# EasyEDA Pro project 300A Hall Power Meter.eprj

# Schematic Schematic1

## Sheets
1 Current Meter: Board Name: Board1; Create Date: 2026-04-24; Page Name: Current Meter; Project Name: 300A Hall Power Meter; Schematic Name: Schematic1; Update Date: 2026-05-06; Company: StarBound; Drawn: Soutsiou S.; Page Size: A4; Version: V1.0
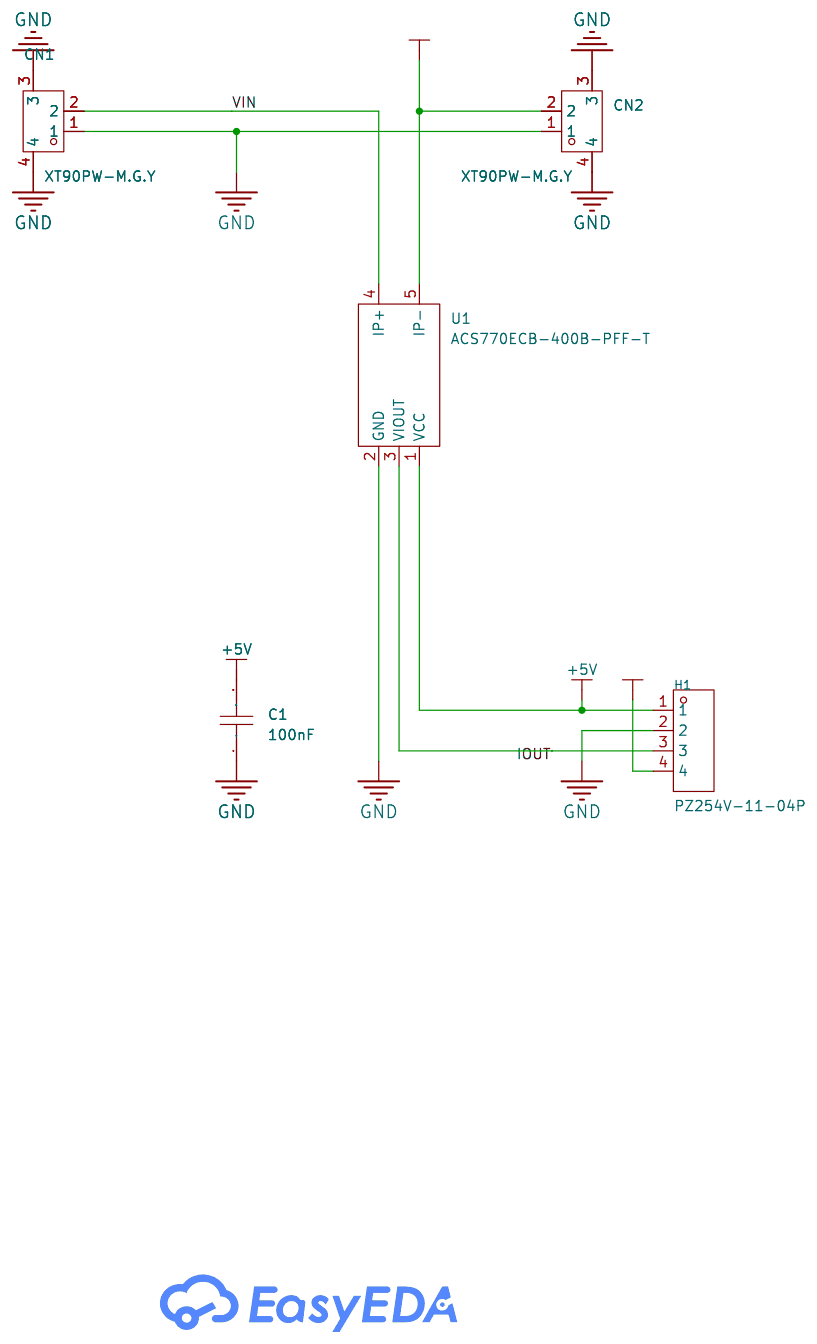
[diagram p0: Current Meter]
2 Buck Converter: Create Date: 2026-04-25; Page Name: Buck Converter; Company: EasyEDA.com
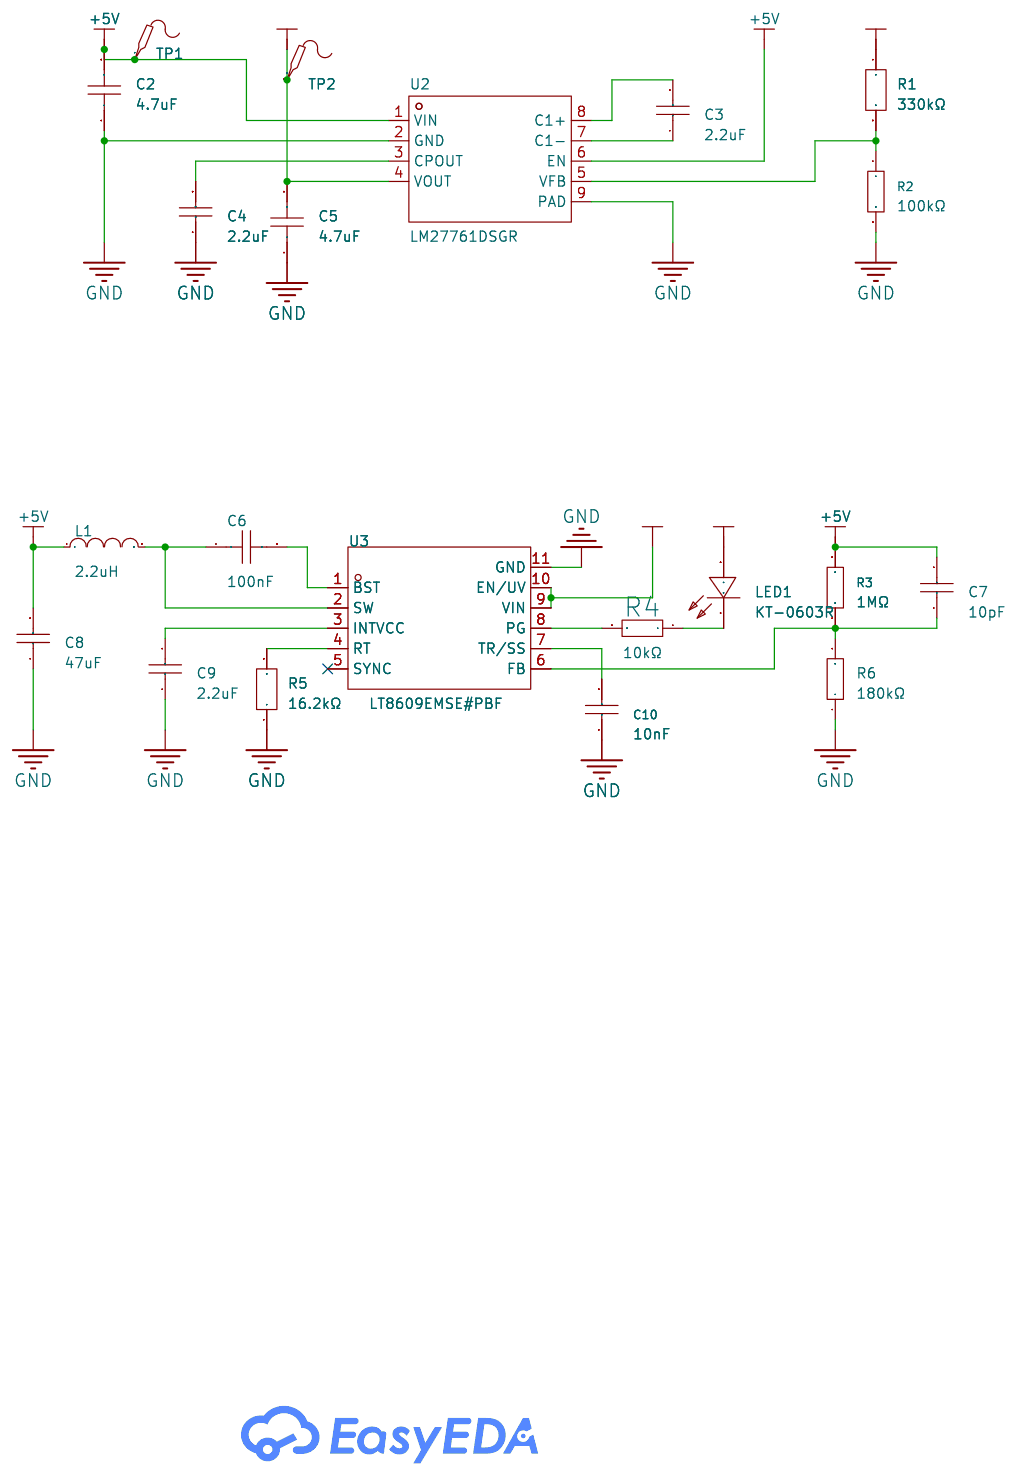
[diagram p1: Buck Converter]
3 Signal Processing: Create Date: 2026-04-25; Page Name: Signal Processing; Company: EasyEDA.com
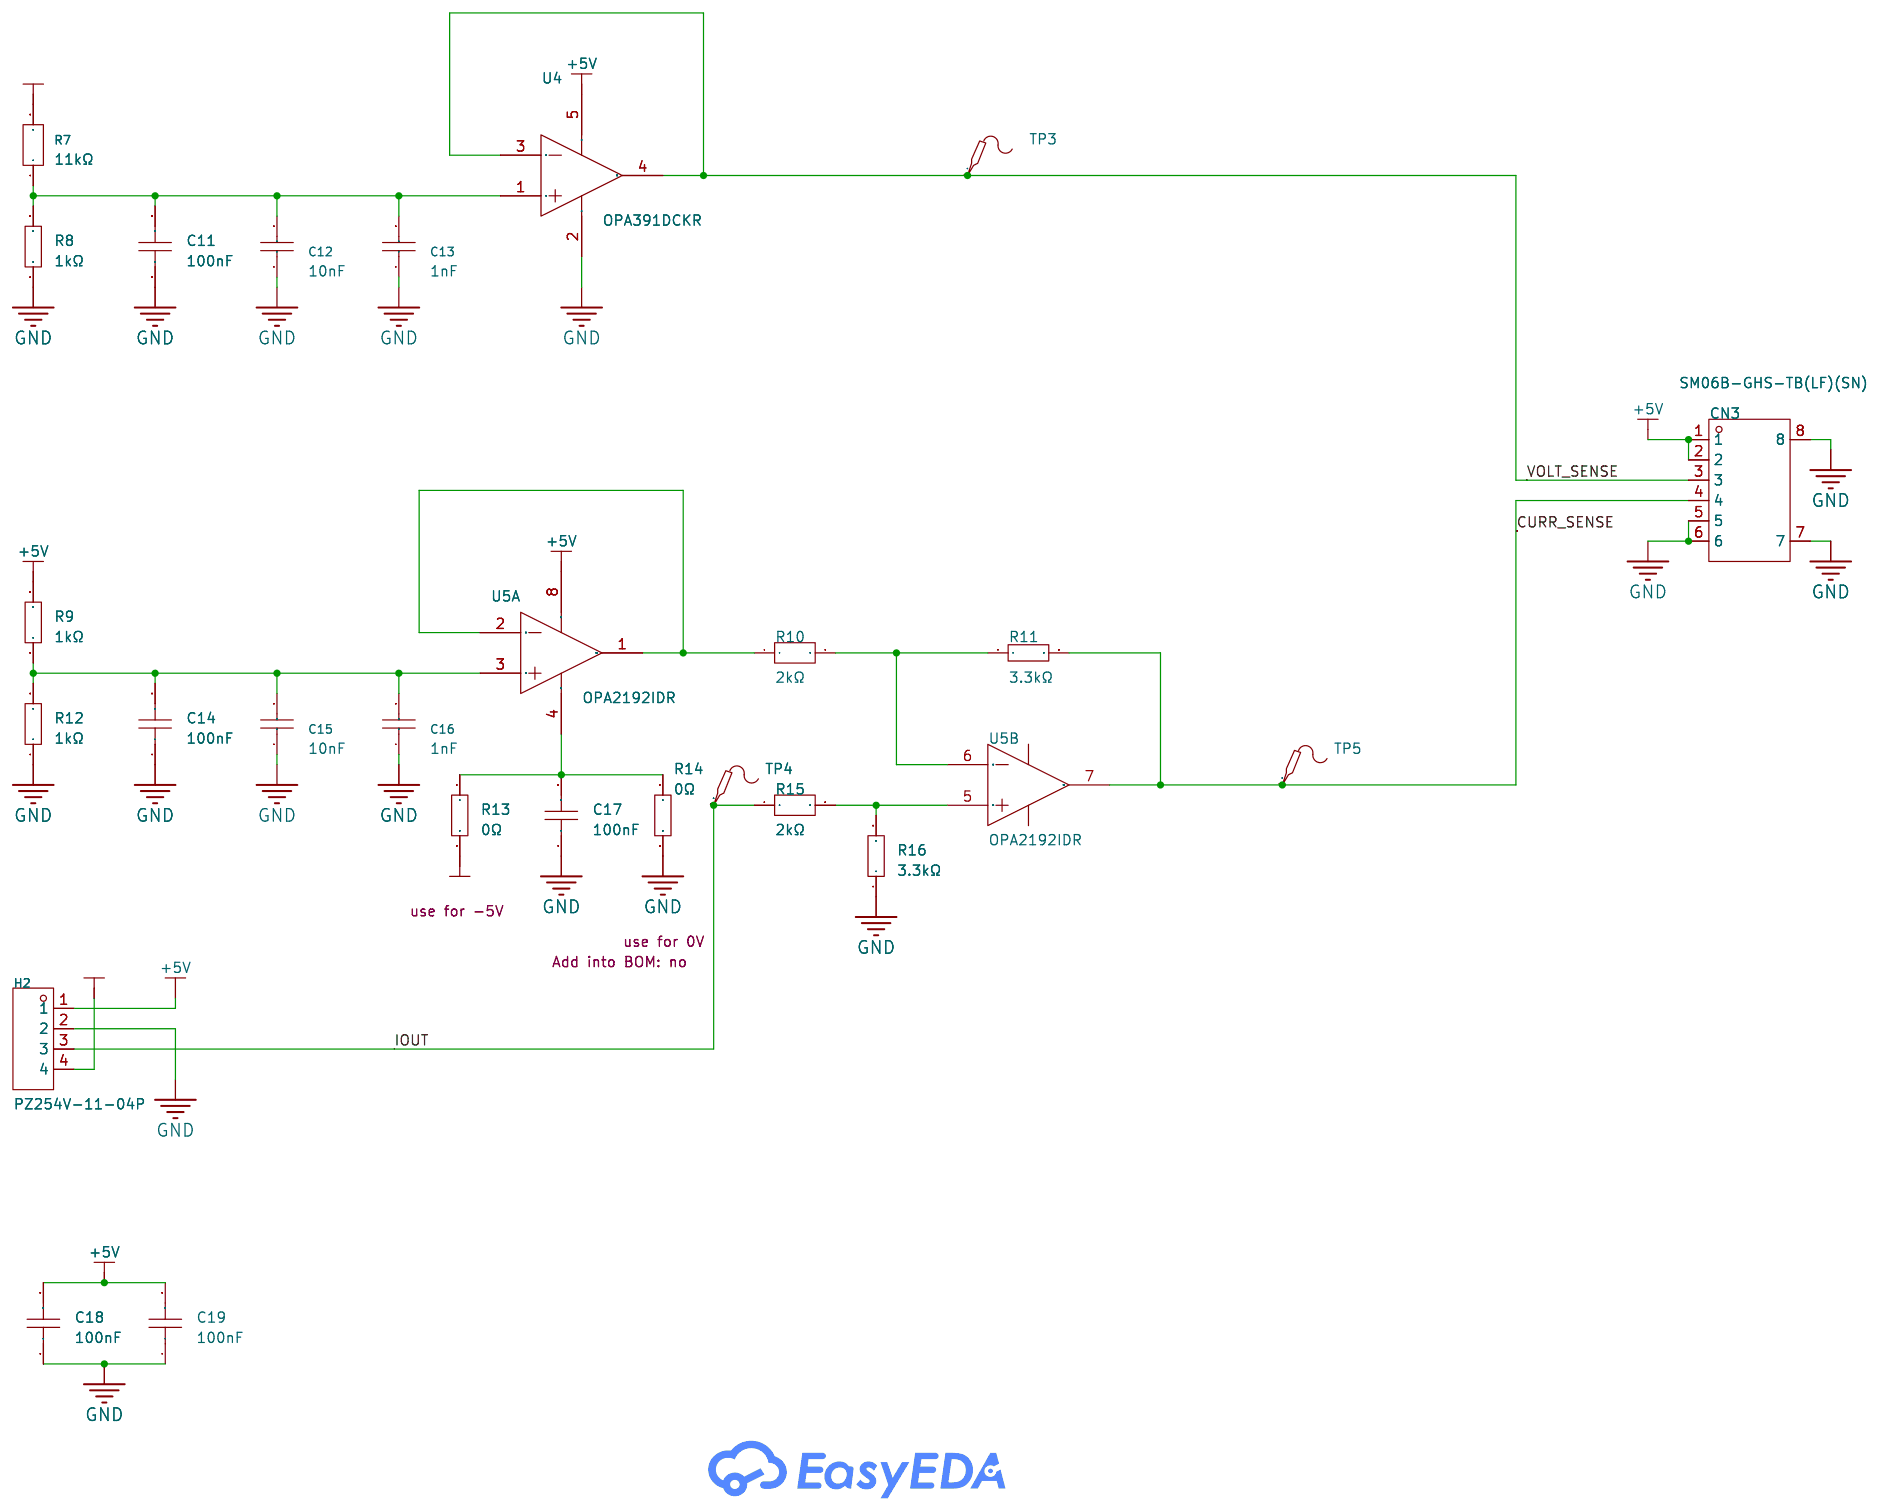
[diagram p2: Signal Processing]

## Parts
sheet Buck Converter
C2  4.7uF  [C0603]
C3  2.2uF  [C0603]
C4  2.2uF  [C0603]
C5  4.7uF  [C0603]
C6  100nF  [C0603]
C7  10pF  [C0603]
C8  47uF  [C0805]
C9  2.2uF  [C0603]
C10  10nF  [C0603]
L1  2.2uH  [IND-SMD_L4.4-W4.0_PHC0420]
LED1  KT-0603R  [LED0603-RD]
R1  330kΩ  [R0603]
R2  100kΩ  [R0603]
R3  1MΩ  [R0603]
R4  10kΩ  [R0603]
R5  16.2kΩ  [R0603]
R6  180kΩ  [R0603]
TP1  -  [Test-Point-0.5mm]
TP2  -  [Test-Point-0.5mm]
U2  LM27761DSGR  [WSON-8_L2.0-W2.0-P0.65-BL-EP]
U3  LT8609EMSE#PBF  [MSOP-10_L3.0-W3.0-P0.50-LS5.0-BL-EP]
sheet Current Meter
C1  100nF  [C0402]
CN1  XT90PW-M.G.Y  [CONN-TH_XT90PW-M.G.Y]  (no BOM)
CN2  XT90PW-M.G.Y  [CONN-TH_XT90PW-M.G.Y]  (no BOM)
H1  PZ254V-11-04P  [HDR-TH_4P-P2.54-V-M]
U1  ACS770ECB-400B-PFF-T  [CB-5_L13.0-W10.0-P1.91-LS21.4-BR]
sheet Signal Processing
C11  100nF  [C0402]
C12  10nF  [C0603]
C13  1nF  [C0603]
C14  100nF  [C0402]
C15  10nF  [C0603]
C16  1nF  [C0603]
C17  100nF  [C0402]
C18  100nF  [C0402]
C19  100nF  [C0402]
CN3  SM06B-GHS-TB(LF)(SN)  [CONN-TH_SM06B-GHS-TB-LF-SN]
H2  PZ254V-11-04P  [HDR-TH_4P-P2.54-V-M]  (no BOM)
R7  11kΩ  [R0603]
R8  1kΩ  [R0603]
R9  1kΩ  [R0603]
R10  2kΩ  [R0603]
R11  3.3kΩ  [R0603]
R12  1kΩ  [R0603]
R13  0Ω  [R0603]
R14  0Ω  [R0603]  (no BOM)
R15  2kΩ  [R0603]
R16  3.3kΩ  [R0603]
TP3  -  [Test-Point-0.5mm]
TP4  -  [Test-Point-0.5mm]
TP5  -  [Test-Point-0.5mm]
U4  OPA391DCKR  [SC-70-5_L2.1-W1.3-P0.65-LS2.1-BR]
U5  OPA2192IDR  [SOIC-8_L4.9-W3.9-P1.27-LS6.0-BL]  (sections 1,2)

## Library data of the parts
C2 C5 = CL10A475KO8NNNC: LCSC Part Name: 4.7uF ±10% 16V; Supplier Part: C19666; Manufacturer: SAMSUNG(三星); Supplier Footprint: 0603; JLCPCB Part Class: Basic Part; Datasheet: https://item.szlcsc.com/datasheet/CL10A475KO8NNNC/20375.html; Supplier: LCSC; Tolerance: ±10%; Voltage Rating: 16V; Temperature Coefficient: X5R
C3 C4 C9 = CL10A225KO8NNNC: LCSC Part Name: 2.2uF ±10% 16V; Supplier Part: C23630; Manufacturer: SAMSUNG(三星); Supplier Footprint: 0603; JLCPCB Part Class: Basic Part; Datasheet: https://item.szlcsc.com/datasheet/CL10A225KO8NNNC/24366.html; Supplier: LCSC; Tolerance: ±10%; Voltage Rating: 16V; Temperature Coefficient: X5R
C6 = CC0603KRX7R9BB104: LCSC Part Name: 100nF ±10% 50V; Supplier Part: C14663; Manufacturer: YAGEO(国巨); Supplier Footprint: 0603; JLCPCB Part Class: Basic Part; Datasheet: https://item.szlcsc.com/datasheet/CC0603KRX7R9BB104/15331.html; Supplier: LCSC; Tolerance: ±10%; Voltage Rating: 50V; Temperature Coefficient: X7R
C7 = CL10C100JB8NNNC: LCSC Part Name: 10pF ±5% 50V; Supplier Part: C1634; Manufacturer: SAMSUNG(三星); Supplier Footprint: 0603; JLCPCB Part Class: Basic Part; Datasheet: https://item.szlcsc.com/datasheet/CL10C100JB8NNNC/1986.html; Supplier: LCSC; Tolerance: ±5%; Voltage Rating: 50V; Temperature Coefficient: C0G
C8 = CL21A476MQYNNNE: LCSC Part Name: 47uF ±20% 6.3V; Supplier Part: C16780; Manufacturer: SAMSUNG(三星); Supplier Footprint: 0805; JLCPCB Part Class: Basic Part; Datasheet: https://item.szlcsc.com/datasheet/CL21A476MQYNNNE/17464.html; Supplier: LCSC; Tolerance: ±20%; Voltage Rating: 6.3V; Temperature Coefficient: X5R
C10 C12 C15 = 0603B103K500NT: LCSC Part Name: 10nF ±10% 50V; Supplier Part: C57112; Manufacturer: FH(风华); Supplier Footprint: 0603; JLCPCB Part Class: Basic Part; Datasheet: https://item.szlcsc.com/datasheet/0603B103K500NT/58143.html; Supplier: LCSC; Tolerance: ±10%; Voltage Rating: 50V; Temperature Coefficient: X7R
L1 = APH0420T2R2M: LCSC Part Name: 2.2uH ±20% 5A; Supplier Part: C5349665; Manufacturer: APV(爱普微); Supplier Footprint: SMD,4.4x4.2mm; JLCPCB Part Class: Extended Part; Datasheet: https://item.szlcsc.com/datasheet/APH0420T2R2M/6135080.html; Supplier: LCSC; Tolerance: ±20%; Current Rating: 4.5A; Current - Saturation(Isat): 5A; DC Resistance(DCR): 58mΩ; Type: Molded Inductor
LED1 = KT-0603R: LCSC Part Name: 0603 红灯 高亮; Supplier Part: C2286; Manufacturer: KENTO; Supplier Footprint: 0603; JLCPCB Part Class: Basic Part; Datasheet: https://item.szlcsc.com/datasheet/KT-0603R/2659.html; Supplier: LCSC; Illumination Color: Red; Voltage - Forward(Vf): 1.8V~2.4V; Power(Watts): 40mW; Forward Current: 20mA; Wavelength - Dominant: 615nm~630nm; Peak Wavelength: 645nm; Diode Configuration: Discrete Diode; Lens Color: Water Clear; Luminous Intensity: 300mcd; Viewing Angle: 120°; Operating Temperature: -40℃~+85℃
R1 = FRC0603F3303TS: LCSC Part Name: 330kΩ ±1% 100mW 厚膜电阻; Supplier Part: C2907027; Manufacturer: FOJAN(富捷); Supplier Footprint: 0603; JLCPCB Part Class: Extended Part; Supplier: LCSC; Type: Thick Film Resistor; Tolerance: ±1%; Power(Watts): 100mW; Voltage-Supply(Max): 75V; Temperature Coefficient: ±100ppm/℃; Operating Temperature: -55℃~+155℃
R2 = RC0603FR-07100KL: LCSC Part Name: 厚膜电阻 100kΩ ±1% 100mW; Supplier Part: C14675; Manufacturer: YAGEO(国巨); Supplier Footprint: 0603; JLCPCB Part Class: Extended Part; Datasheet: https://atta.szlcsc.com/upload/public/pdf/source/20140324/1457707028752.pdf; Supplier: LCSC; Type: Thick Film Resistors; Tolerance: ±1%; Temperature Coefficient: ±100ppm/℃; Operating Temperature Range: -55℃~+155℃
R3 = 0603WAF1004T5E: LCSC Part Name: 1MΩ ±1% 100mW 厚膜电阻; Supplier Part: C22935; Manufacturer: UNI-ROYAL(厚声); Supplier Footprint: 0603; JLCPCB Part Class: Basic Part; Datasheet: https://atta.szlcsc.com/upload/public/pdf/source/20200306/C422600_1E6D84923E4A46A82E41ADD87F860B5C.pdf; Supplier: LCSC; Type: Thick Film Resistors; Tolerance: ±1%; Temperature Coefficient: ±100ppm/℃; Operating Temperature Range: -55℃~+155℃
R4 = 0603WAF1002T5E: LCSC Part Name: 厚膜电阻 10kΩ ±1% 100mW; Supplier Part: C25804; Manufacturer: UNI-ROYAL(厚声); Supplier Footprint: 0603; JLCPCB Part Class: Basic Part; Datasheet: https://item.szlcsc.com/datasheet/0603WAF1002T5E/26547.html; Supplier: LCSC; Type: Thick Film Resistor; Tolerance: ±1%; Power(Watts): 100mW; Voltage-Supply(Max): 75V; Temperature Coefficient: ±100ppm/℃; Operating Temperature: -55℃~+155℃
R5 = RT0603BRD0716K2L: LCSC Part Name: 薄膜电阻 16.2kΩ ±0.1% 100mW; Supplier Part: C728583; Manufacturer: YAGEO(国巨); Supplier Footprint: 0603; JLCPCB Part Class: Extended Part; Datasheet: https://item.szlcsc.com/datasheet/RT0603BRD0716K2L/775898.html; Supplier: LCSC; Type: Thin Film Resistor; Tolerance: ±0.1%; Power(Watts): 100mW; Voltage-Supply(Max): 75V; Temperature Coefficient: ±25ppm/℃; Operating Temperature: -55℃~+155℃
R6 = 0603WAF1803T5E: LCSC Part Name: 180kΩ ±1% 100mW 厚膜电阻; Supplier Part: C22827; Manufacturer: UNI-ROYAL(厚声); Supplier Footprint: 0603; JLCPCB Part Class: Extended Part; Datasheet: https://item.szlcsc.com/datasheet/0603WAF1803T5E/23554.html; Supplier: LCSC; Type: Thick Film Resistor; Tolerance: ±1%; Power(Watts): 100mW; Voltage-Supply(Max): 75V; Temperature Coefficient: ±100ppm/℃; Operating Temperature: -55℃~+155℃
TP1-TP5 = Test-Point
U2 = LM27761DSGR: LCSC Part Name: 具有集成 LDO 的低噪声稳压逆变器; Supplier Part: C129351; Manufacturer: TI(德州仪器); Supplier Footprint: WFDFN-8-EP(2x2); JLCPCB Part Class: Extended Part; Datasheet: https://www.ti.com/cn/lit/gpn/lm27761; Supplier: LCSC
U3 = LT8609EMSE#PBF: LCSC Part Name: 42V, 3A 同步降压调节器，超低静态电流; Supplier Part: C580303; Manufacturer: ADI(亚德诺); Supplier Footprint: MSOP-10-EP; JLCPCB Part Class: Extended Part; Datasheet: https://atta.szlcsc.com/upload/public/pdf/source/20210607/C580303_E161E74519E3273A170D86DE8F8D4B9F.pdf; Supplier: LCSC; Function: Step-down type; Output Type: Adjustable; Input Voltage: 3V~42V; Output Current: 3A; Switching Frequency: 200kHz~2.2MHz; Operating Temperature: -40℃~+125℃; Synchronous Rectification: Yes; Number of Outputs: 1; Topology: Step-down; Switch tube (built-in/external): Built-in
C1 C11 C14 C17-C19 = CL05B104KO5NNNC: LCSC Part Name: 100nF ±10% 16V; Supplier Part: C1525; Manufacturer: SAMSUNG(三星); Supplier Footprint: 0402; JLCPCB Part Class: Basic Part; Datasheet: https://item.szlcsc.com/datasheet/CL05B104KO5NNNC/1877.html; Supplier: LCSC; Tolerance: ±10%; Voltage Rating: 16V; Temperature Coefficient: X7R
CN1 CN2 = XT90PW-M.G.Y: LCSC Part Name: AMASS(艾迈斯)PCB焊板式卧式航模连接器 锂电池大电流插头 30A二芯PCB直插 镀金 黄色 公头XT90PW-M.G.Y; Supplier Part: C3040689; Manufacturer: AMASS(艾迈斯); JLCPCB Part Class: Extended Part; Datasheet: https://item.szlcsc.com/datasheet/XT90PW-M.G.Y/3598456.html; Supplier: LCSC; colour: Yellow; Connector type: Plug; metal material: Gold plating
H1 H2 = PZ254V-11-04P: LCSC Part Name: 1x4P 间距:2.54mm 方针 直插; Supplier Part: C2691448; Manufacturer: XFCN(兴飞); Supplier Footprint: 插件,P=2.54mm; JLCPCB Part Class: Extended Part; Datasheet: https://item.szlcsc.com/datasheet/PZ254V-11-04P/2801085.html; Supplier: LCSC; Pin Structure: 1x4P; Pitch: 2.54mm; Circluar Pins/Square Pins: Pin Header; Mounting Type: Through Hole; Number of Rows: 1; Number of Pins: 4P; Current Rating: 3A; Voltage Rating (Max): 250V; Length of Mating Pin: 6mm; Insulation Height: 2.5mm; Length of End Connection Pin: 3mm; Operating Temperature: -40℃~+105℃; Color: Black
U1 = ACS770ECB-400B-PFF-T: Supplier Part: C32246945; Manufacturer: ALLEGRO(美国埃戈罗); Datasheet: https://item.szlcsc.com/datasheet/ACS770ECB-400B-PFF-T/33981175.html; Supplier: LCSC
C13 C16 = CL10B102KB8NNNC: LCSC Part Name: 1nF ±10% 50V; Supplier Part: C1588; Manufacturer: SAMSUNG(三星); Supplier Footprint: 0603; JLCPCB Part Class: Basic Part; Datasheet: https://item.szlcsc.com/datasheet/CL10B102KB8NNNC/1940.html; Supplier: LCSC; Tolerance: ±10%; Voltage Rating: 50V; Temperature Coefficient: X7R
CN3 = SM06B-GHS-TB(LF)(SN): LCSC Part Name: 1x6P 间距:1.25mm 卧贴 系列:GH; Supplier Part: C133065; Manufacturer: JST; Supplier Footprint: SMD,P=1.25mm,卧贴; JLCPCB Part Class: Extended Part; Datasheet: https://item.szlcsc.com/datasheet/SM06B-GHS-TB(LF)(SN)/144367.html; Supplier: LCSC; Pins Structure: 1x6P; Pitch: 1.25mm; Mounting Type: Surface Mount, Right Angle; Reference Series: GH; Number of Pins: 6P; Number of Rows: 1; Number of PINs Per Row: 6; Current Rating: 1A; Contact Material: Phosphor Bronze; Contact Plating: Tin; Operating Temperature: -25℃~+85℃; Voltage Rating: 50V; Plastic Material: PA9T; Flame Retardant Rating: UL94V-0; Supplementary Features: Auxiliary Solder Pin; Color: White; Z-Height of the Board: 4.25mm; X-Length of Bottom Edge on Board (Spacing Line): 10.75mm; Y-Width of Bottom Edge on Board: 4.13mm
R7 = ERA3AEB113V: LCSC Part Name: 11kΩ ±0.1% 100mW 薄膜电阻; Supplier Part: C473242; Manufacturer: PANASONIC(松下); Supplier Footprint: 0603; JLCPCB Part Class: Extended Part; Datasheet: https://atta.szlcsc.com/upload/public/pdf/source/20200515/C543414_D3FB4A44C151AC19BA141503575FC797.pdf; Supplier: LCSC; Type: Thin Film Resistor; Tolerance: ±0.1%; Temperature Coefficient: ±25ppm/℃; Operating Temperature Range: -55℃~+155℃
R8 R9 R12 = RT0603BRD071KL: LCSC Part Name: 薄膜电阻 1kΩ ±0.1% 100mW; Supplier Part: C110776; Manufacturer: YAGEO(国巨); Supplier Footprint: 0603; JLCPCB Part Class: Extended Part; Datasheet: https://atta.szlcsc.com/upload/public/pdf/source/20170704/1499151282044.pdf; Supplier: LCSC; Type: Thin Film Resistor; Tolerance: ±0.1%; Temperature Coefficient: ±25ppm/℃; Operating Temperature Range: -55℃~+155℃
R10 R15 = RT0603BRD072KL: LCSC Part Name: 薄膜电阻 2kΩ ±0.1% 100mW; Supplier Part: C728588; Manufacturer: YAGEO(国巨); Supplier Footprint: 0603; JLCPCB Part Class: Extended Part; Datasheet: https://atta.szlcsc.com/upload/public/pdf/source/20200814/C723483_9C38DBFE9BAEFED0FBB9716EAA9FF07C.pdf; Supplier: LCSC; Type: Thin Film Resistor; Tolerance: ±0.1%; Temperature Coefficient: ±25ppm/℃; Operating Temperature Range: -55℃~+155℃
R11 R16 = RT0603BRD073K3L: LCSC Part Name: 薄膜电阻 3.3kΩ ±0.1% 100mW; Supplier Part: C309653; Manufacturer: YAGEO(国巨); Supplier Footprint: 0603; JLCPCB Part Class: Extended Part; Datasheet: https://item.szlcsc.com/datasheet/RT0603BRD073K3L/293269.html; Supplier: LCSC; Type: Thin Film Resistor; Tolerance: ±0.1%; Power(Watts): 100mW; Voltage-Supply(Max): 75V; Temperature Coefficient: ±25ppm/℃; Operating Temperature: -55℃~+155℃
R13 = RC0603JR-070RL: LCSC Part Name: 厚膜电阻 0Ω ±5% 100mW; Supplier Part: C95177; Manufacturer: YAGEO(国巨); Supplier Footprint: 0603; JLCPCB Part Class: Extended Part; Datasheet: https://atta.szlcsc.com/upload/public/pdf/source/20170818/C126805_1503051298841895366.pdf; Supplier: LCSC; Type: Thick Film Resistors; Tolerance: ±5%; Operating Temperature Range: -55℃~+155℃; Comment: use for -5V
R14 = RC0603JR-070RL: LCSC Part Name: 厚膜电阻 0Ω ±5% 100mW; Supplier Part: C95177; Manufacturer: YAGEO(国巨); Supplier Footprint: 0603; JLCPCB Part Class: Extended Part; Datasheet: https://atta.szlcsc.com/upload/public/pdf/source/20170818/C126805_1503051298841895366.pdf; Supplier: LCSC; Type: Thick Film Resistors; Tolerance: ±5%; Operating Temperature Range: -55℃~+155℃; Comment: use for 0V
U4 = OPA391DCKR: LCSC Part Name: OPAx391超低lQ、低失调电压、e-trim精密运算放大器; Supplier Part: C2871876; Manufacturer: TI(德州仪器); Supplier Footprint: SC-70-5; JLCPCB Part Class: Extended Part; Datasheet: https://www.ti.com/cn/lit/gpn/opa391; Supplier: LCSC; Number of Channels: 1; Maximum Power Supply Range (Vdd-Vss): 5.5V; Rail to Rail: Rail-to-Rail Output; Gain Bandwidth Product: 1MHz; Vos - Input Offset Voltage: 45uV; Input Offset Voltage Drift(Vos TC): 1uV/℃; Slew Rate: 1V/us; Ib - Input Bias Current: 0.8pA; Input Offset Current(Ios): 5pA; Input Voltage Noise Density: 60nV/√Hz@1kHz; Common Mode Rejection Ratio(CMRR): 121dB; Quiescent Current: 24uA; Output Current: 60mA; Operating Temperature: -40℃~+125℃; Single supply: 1.7V~5.5V; Dual Supply: 850mV~2.75V；-2.75V~-850mV
U5 = OPA2192IDR: Supplier Part: C110074; Manufacturer: TI(德州仪器); Supplier Footprint: SOIC-8; JLCPCB Part Class: Extended Part; Datasheet: https://www.ti.com/cn/lit/gpn/opa2192; Supplier: LCSC; Number of Channels: 2; Gain Bandwidth Product: 10MHz; Ib - Input Bias Current: 5pA; Slew Rate: 20V/us; Output Current: 65mA; Rail to Rail: Rail-to-Rail Input, Rail-to-Rail Output; Quiescent Current(Iq): 1mA; Operating Temperature: -40℃~+125℃

## Nets
+5V: C1.2 C2.2 C7.2 C8.2 C18.2 C19.2 CN3.1 CN3.2 H1.1 H2.1 L1.1 R3.2 R9.2 TP1.1 U1.1(VCC) U2.1(VIN) U2.6(EN) U4.5(V+) U5.8(VDD)
-5V: C5.2 R1.1 R13.2 TP2.1 U2.4(VOUT)
GND: C1.1 C2.1 C4.1 C5.1 C8.1 C9.1 C10.1 C11.1 C12.1 C13.1 C14.1 C15.1 C16.1 C17.1 C18.1 C19.1 CN1.1 CN1.3 CN1.4 CN2.1 CN2.3 CN2.4 CN3.5 CN3.6 CN3.7 CN3.8 H1.2 H2.2 R2.2 R5.1 R6.1 R8.1 R12.1 R14.2 R16.1 U1.2(GND) U2.2(GND) U2.9(PAD) U3.11(GND) U4.2(V-)
VIN: CN1.2 U1.4(IP+)
CURR_SENSE: CN3.4 R11.2 TP5.1 U5.7(VOUTB)
IOUT: H1.3 H2.3 R15.1 TP4.1 U1.3(VIOUT)
VOLT_SENSE: CN3.3 TP3.1 U4.3(IN-) U4.4(OUT)
VOUT: CN2.2 H1.4 H2.4 LED1.2(A) R7.2 U1.5(IP-) U3.9(VIN) U3.10(EN/UV)
$2N1941: C3.2 U2.8(C1+)
$2N1954: C3.1 U2.7(C1-)
$2N2099: C4.2 U2.3(CPOUT)
$2N2496: C9.2 U3.3(INTVCC)
$2N2548: C6.2 U3.1(BST)
$2N2555: C6.1 L1.2 U3.2(SW)
$2N2851: C7.1 R3.1 R6.2 U3.6(FB)
$2N2997: R5.2 U3.4(RT)
$2N3104: C10.2 U3.7(TR/SS)
$2N3367: LED1.1(K) R4.1
$2N3370: R4.2 U3.8(PG)
$2N3554: R1.2 R2.1 U2.5(VFB)
$3N1151: C14.2 C15.2 C16.2 R9.1 R12.2 U5.3(VINA+)
$3N1179: C11.2 C12.2 C13.2 R7.1 R8.2 U4.1(IN+)
$3N1197: R10.1 U5.1(VOUTA) U5.2(VINA-)
$3N1204: R10.2 R11.1 U5.6(VINB-)
$3N1213: R15.2 R16.2 U5.5(VINB+)
$3N9954: C17.2 R13.1 R14.1 U5.4(VSS)

Not connected (* = marked no-connect by the designer): U3 5(SYNC)*

# Board PCB1
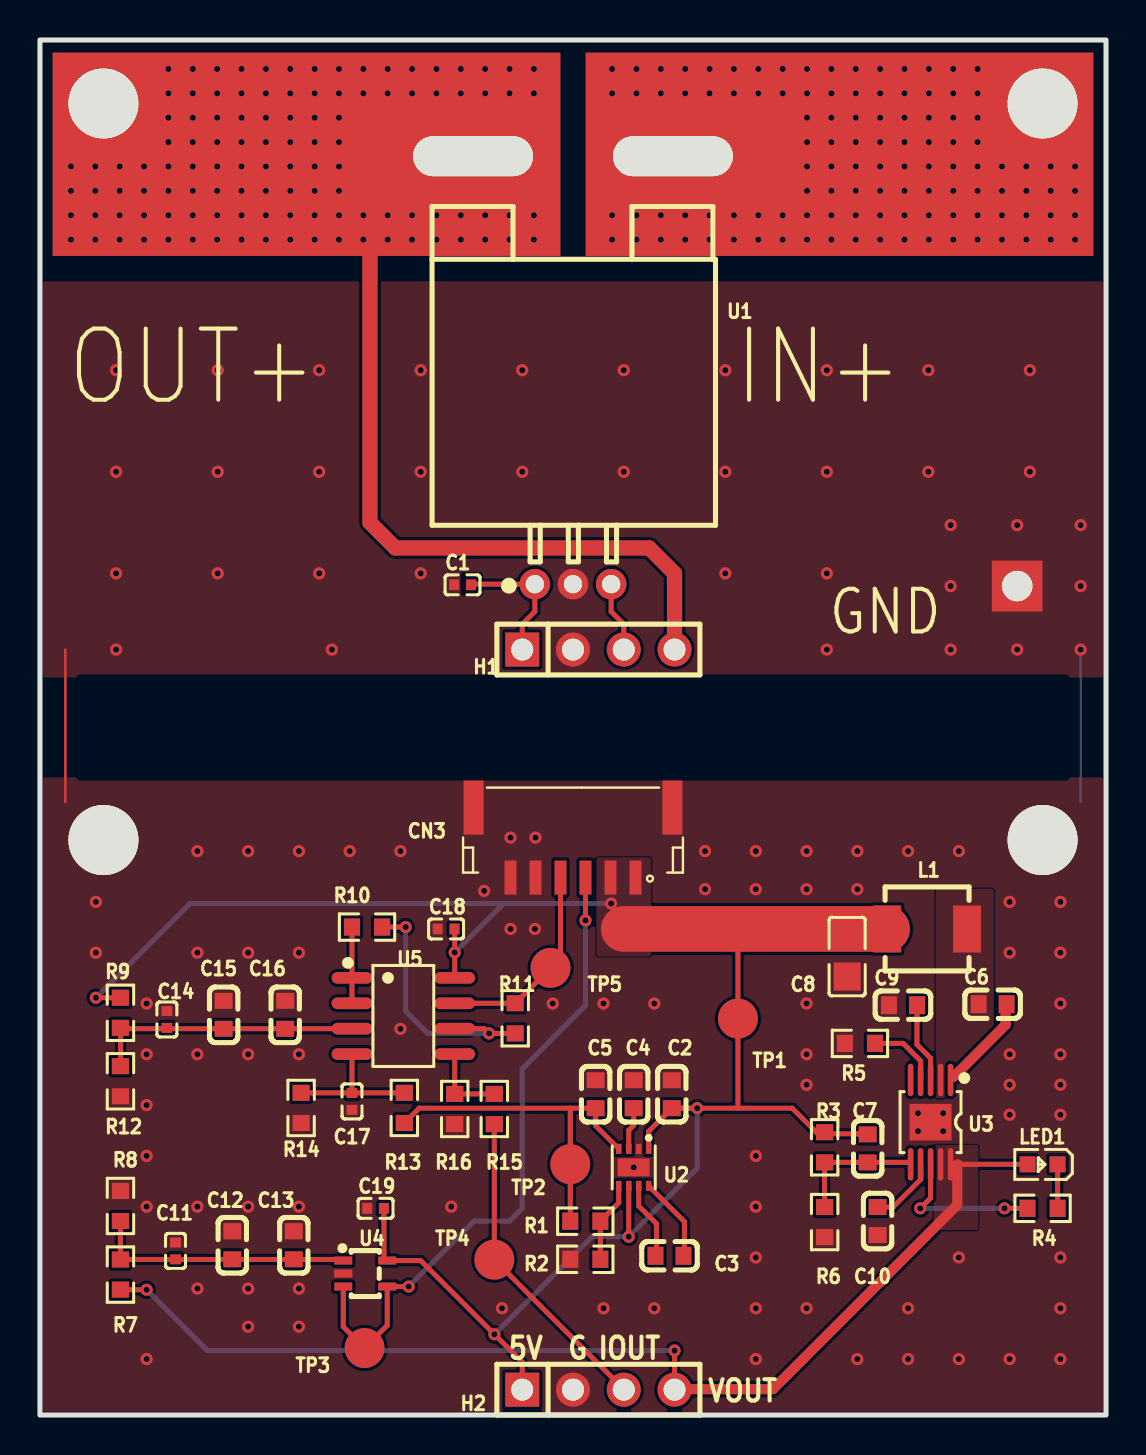
[diagram p3: board, top side]
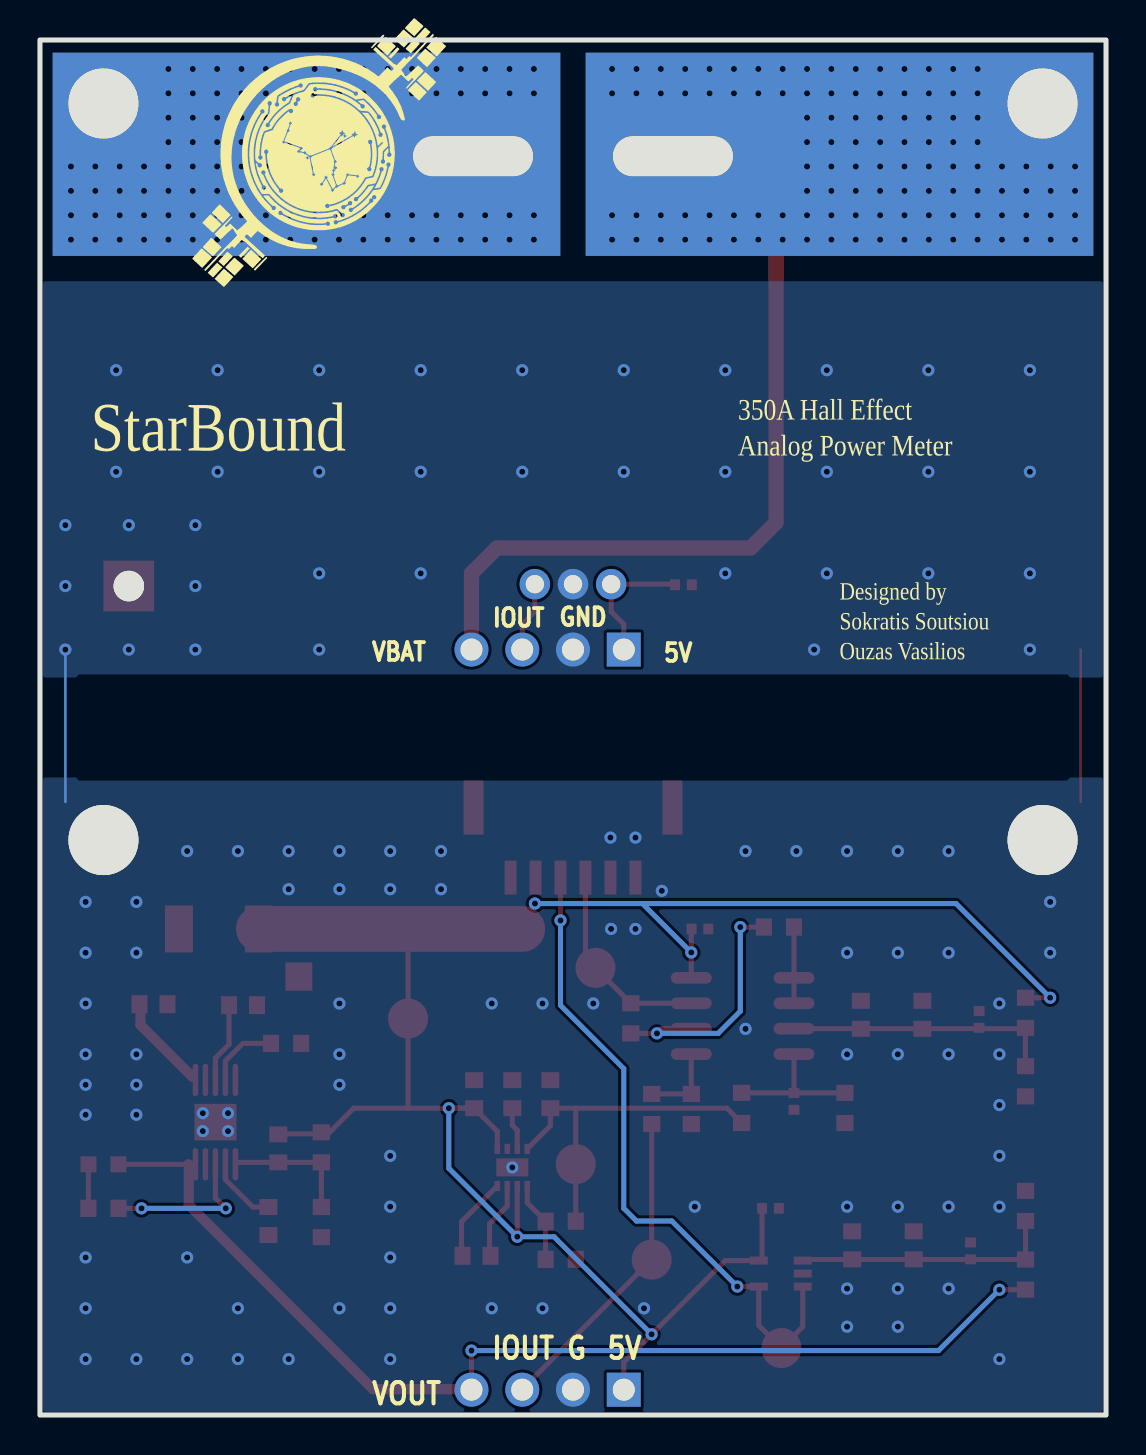
[diagram p4: board, bottom side, seen from below]

Outline 53.34 x 68.75 mm; copper layers: Top Layer, Bottom Layer. Coordinates in mm from the lower left corner of the outline.
Outline path: rectangle 0,68.75 53.34,0
Stack: Top Layer 0.035mm / Dielectric1 1.51mm FR4 er 4.5 / Bottom Layer 0.035mm

## Design rules (mm)
template: Custom Config
spacing copperThickness1oz (default): track to track 0.102, other pairs 0.152 to 0.3
spacing copperThickness2oz: track to track 0.203, other pairs 0.152 to 0.3
track width copperThickness1oz (default): min 0.127, default 0.254, max 2.54
track width copperThickness2oz: min 0.203, default 0.254, max 2.54
differential pair differentialPair (default): width min 0.127, default 0.254, max 2.54; gap min 0.152, default 0.152
via viaSize (default): diameter min 0.5, default 0.61, max 10; hole min 0.3, default 0.305, max 6.3

## Placement (name value [footprint] x y rotation side)
C1  100nF  [C0402]  21.14 41.51 0 top
C2  4.7uF  [C0603]  31.61 16.04 270 top
C3  2.2uF  [C0603]  31.5 7.96 0 top
C4  2.2uF  [C0603]  29.71 16.04 270 top
C5  4.7uF  [C0603]  27.8 16.04 270 top
C6  100nF  [C0603]  47.66 20.54 0 top
C7  10pF  [C0603]  41.41 13.33 90 top
C8  47uF  [C0805]  40.39 22.92 90 top
C9  2.2uF  [C0603]  43.18 20.49 0 top
C10  10nF  [C0603]  41.91 9.7 90 top
C11  100nF  [C0402]  6.78 8.21 270 top
C12  10nF  [C0603]  9.62 8.49 270 top
C13  1nF  [C0603]  12.7 8.49 270 top
C14  100nF  [C0402]  6.35 19.78 270 top
C15  10nF  [C0603]  9.19 20.01 270 top
C16  1nF  [C0603]  12.27 20.01 270 top
C17  100nF  [C0402]  15.61 15.68 90 top
C18  100nF  [C0402]  20.32 24.3 0 top
C19  100nF  [C0402]  16.79 10.33 0 top
CN3  SM06B-GHS-TB(LF)(SN)  [CONN-TH_SM06B-GHS-TB-LF-SN]  26.67 28.62 180 top
H1  PZ254V-11-04P  [HDR-TH_4P-P2.54-V-M]  27.94 38.27 0 top
H2  PZ254V-11-04P  [HDR-TH_4P-P2.54-V-M]  27.94 1.27 0 top
L1  2.2uH  [IND-SMD_L4.4-W4.0_PHC0420]  44.39 24.3 0 top
LED1  KT-0603R  [LED0603-RD]  50.16 12.53 180 top
NOREF  -  [Pad_e146]  48.9 41.45 0 top
NOREF#2  -  [Pad_e307]  3.17 65.58 0 top
NOREF#3  -  [Pad_e83]  13.34 63.04 0 top
NOREF#4  -  [Pad_e87]  13.34 63.04 0 top
NOREF#5  -  [Pad_e309]  50.16 65.58 0 top
NOREF#6  -  [Pad_e88]  40 63.04 0 top
NOREF#7  -  [Pad_e325]  50.16 28.75 0 top
NOREF#8  -  [Pad_e86]  40 63.04 0 top
NOREF#9  -  [Pad_e324]  3.17 28.75 0 top
NOREF#10  -  [Pad_e196]  48.9 41.45 0 top
R1  330kΩ  [R0603]  27.29 9.69 0 top
R2  100kΩ  [R0603]  27.29 7.79 180 top
R3  1MΩ  [R0603]  39.26 13.39 90 top
R4  10kΩ  [R0603]  50.16 10.33 180 top
R5  16.2kΩ  [R0603]  41.03 18.58 0 top
R6  180kΩ  [R0603]  39.26 9.65 90 top
R7  11kΩ  [R0603]  4.03 7.02 270 top
R8  1kΩ  [R0603]  4.03 10.45 270 top
R9  1kΩ  [R0603]  4.03 20.11 90 top
R10  2kΩ  [R0603]  16.37 24.4 0 top
R11  3.3kΩ  [R0603]  23.78 19.83 90 top
R12  1kΩ  [R0603]  4.03 16.69 90 top
R13  0Ω  [R0603]  18.23 15.35 270 top
R14  0Ω  [R0603]  13.07 15.35 270 top
R15  2kΩ  [R0603]  22.73 15.3 90 top
R16  3.3kΩ  [R0603]  20.75 15.3 90 top
TP1  -  [Test-Point-0.5mm]  34.92 19.82 0 top
TP2  -  [Test-Point-0.5mm]  26.53 12.54 0 top
TP3  -  [Test-Point-0.5mm]  16.24 3.35 0 top
TP4  -  [Test-Point-0.5mm]  22.73 7.77 0 top
TP5  -  [Test-Point-0.5mm]  25.55 22.36 0 top
U1  ACS770ECB-400B-PFF-T  [CB-5_L13.0-W10.0-P1.91-LS21.4-BR]  26.67 52.24 270 top
U2  LM27761DSGR  [WSON-8_L2.0-W2.0-P0.65-BL-EP]  29.71 12.38 180 top
U3  LT8609EMSE#PBF  [MSOP-10_L3.0-W3.0-P0.50-LS5.0-BL-EP]  44.56 14.64 180 top
U4  OPA391DCKR  [SC-70-5_L2.1-W1.3-P0.65-LS2.1-BR]  16.28 7.07 180 top
U5  OPA2192IDR  [SOIC-8_L4.9-W3.9-P1.27-LS6.0-BL]  18.18 19.95 270 top

## Footprints (pads in the part's own frame, mm; a bottom-side part is the same pattern mirrored in y, then rotated)
C0402
  rect 0.5x0.54 smd: 1(-0.42,0) 2(0.42,0)
C0603
  rect 0.8x0.9 smd: 1(-0.7,0) 2(0.7,0)
C0805
  rect 1.41x1.35 smd: 1(-1,0) 2(1,0)
CB-5_L13.0-W10.0-P1.91-LS21.4-BR
  round 1.524 hole 0.914: 1(10.7,-1.91) 2(10.7,0) 3(10.7,1.91)
  oval 4x8.6 hole 2x6: 4(-10.7,5) 5(-10.7,-5)
CONN-TH_SM06B-GHS-TB-LF-SN
  rect 0.6x1.7 smd: 1(-3.126,1.75) 2(-1.875,1.75) 3(-0.625,1.75) 4(0.625,1.75) 5(1.875,1.75) 6(3.124,1.75)
  rect 1x2.7 smd: 7(-4.974,-1.749) 8(4.974,-1.75)
HDR-TH_4P-P2.54-V-M
  rect 1.7x1.7 hole 1.1: 1(-3.81,0)
  round 1.7 hole 1.1: 2(-1.27,0) 3(1.27,0) 4(3.81,0)
IND-SMD_L4.4-W4.0_PHC0420
  rect 1.4x2.35 smd: 1(-2,0) 2(2,0)
LED0603-RD
  rect 0.8x0.8 smd: 1(-0.749,0) 2(0.749,0)
MSOP-10_L3.0-W3.0-P0.50-LS5.0-BL-EP
  oval 0.28x1.62 smd: 1(-1,-2.11) 2(-0.5,-2.11) 3(0,-2.11) 4(0.5,-2.11) 5(1,-2.11) 6(1,2.11) 7(0.5,2.11) 8(0,2.11) 9(-0.5,2.11) 10(-1,2.11)
  rect 2.1x1.83 smd: 11(0,0)
Pad_e83
  custom 0x0 smd: 1(0,0)
Pad_e86
  custom 0x0 smd: 2(0,0)
Pad_e87
  custom 0x0 smd far side: 3(0,0)
Pad_e88
  custom 0x0 smd far side: 12(0,0)
Pad_e146
  rect 2.54x2.54 smd: 2(0,0)
Pad_e196
  round 1.524 hole 1.524: 1(0,0)
Pad_e307
  round 3.5 hole 3.5: 1(0,0)
Pad_e309
  round 3.5 hole 3.5: 1(0,0)
Pad_e324
  round 3.5 hole 3.5: 1(0,0)
Pad_e325
  round 3.5 hole 3.5: 1(0,0)
R0603
  rect 0.806x0.864 smd: 1(-0.753,0) 2(0.753,0)
SC-70-5_L2.1-W1.3-P0.65-LS2.1-BR
  rect 0.9x0.4 smd: 1(1.1,-0.65) 2(1.1,0) 3(1.1,0.65) 4(-1.1,0.65) 5(-1.1,-0.65)
SOIC-8_L4.9-W3.9-P1.27-LS6.0-BL
  oval 0.588x2.045 smd: 1(-1.905,-2.57) 2(-0.635,-2.57) 3(0.635,-2.57) 4(1.905,-2.57) 5(1.905,2.57) 6(0.635,2.57) 7(-0.635,2.57) 8(-1.905,2.57)
Test-Point-0.5mm
  round 2 smd: 1(0,0)
WSON-8_L2.0-W2.0-P0.65-BL-EP
  rect 0.28x0.505 smd: 1(-0.75,-0.927) 2(-0.25,-0.927) 3(0.25,-0.927) 4(0.75,-0.927) 5(0.75,0.927) 6(0.25,0.927) 7(-0.25,0.927) 8(-0.75,0.927)
  rect 1.6x0.9 smd: 9(0,0)

## Nets
As in the schematic, except:
GND: C1.1 C2.1 C4.1 C5.1 C8.1 C9.1 C10.1 C11.1 C12.1 C13.1 C14.1 C15.1 C16.1 C17.1 C18.1 C19.1 CN3.5 CN3.6 CN3.7 CN3.8 H1.2 H2.2 NOREF.2 NOREF#7.1 NOREF#9.1 NOREF#10.1 R2.2 R5.1 R6.1 R8.1 R12.1 R14.2 R16.1 U1.2 U2.2 U2.9 U3.11 U4.2
VIN: NOREF#5.1 NOREF#6.12 NOREF#8.2 U1.4
VOUT: H1.4 H2.4 LED1.2 NOREF#2.1 NOREF#3.1 NOREF#4.3 R7.2 U1.5 U3.9 U3.10

Pads without a net: U3 5

## Via types
v1: diameter 0.61, hole 0.305, Top Layer to Bottom Layer, 359 vias

## Routing (per net, layer and track width the routed paths; a pad name or vN(x,y) marks a point on that pad's centre or on a via; arc(x,y) is an arc through that point)
+5V: length 109.5
  Top Layer w0.254: C2.2 37.64,15.34 38.94,14.04 ; C2.2 v1(32.88,15.34) ; C2.2 30.46,14.19 U2.1 ; 34.93,24.3 34.92,15.34 ; H1.1 24.13,39.54 24.76,40.17 U1.1 21.6,41.54 ; C18.2 20.75,24.29 v1(20.75,23.13) U5.8 ; H2.1 24.13,2.64 v1(22.74,4.03) 19.05,7.72 U4.5 17.21,7.89 C19.2 ; 38.94,14.06 40.97,14.06 41.02,14.01 ; R9.2 v1(2.8,20.86) ; U2.6 v1(29.46,8.91)
  Top Layer w2.286: 29.21,24.3 L1.1
  Bottom Layer w0.254: v1(2.8,20.86) 7.51,25.57 23.2,25.57 ; v1(28.57,25.57) 23.2,25.57 ; 23.2,25.57 v1(20.75,23.13) ; v1(22.74,4.03) 27.62,8.91 v1(29.46,8.91) 32.88,12.34 v1(32.88,15.34)
-5V: length 18
  Top Layer w0.254: 26.53,15.34 TP2.1 R1.1 ; 26.53,15.34 18.97,15.34 R13.2 ; 26.53,15.34 C5.2 27.8,14.46 U2.4
GND: length 15.2
  Top Layer w0.127: 1.27,30.65 1.27,38.27
  Bottom Layer w0.127: 52.07,30.65 v1(52.07,38.27)
  vias: v1(2.8,25.66) v1(2.8,23.12) v1(3.81,52.24) v1(3.81,47.16) v1(3.81,42.08) v1(3.81,38.27) v1(5.34,20.58) v1(5.34,18.04) v1(5.34,15.5) v1(5.34,12.96) v1(5.34,10.42) v1(5.34,2.8) v1(7.88,28.2) v1(7.88,23.12) v1(7.88,18.04) v1(7.88,10.42) v1(7.88,6.32) v1(8.89,52.24) v1(8.89,47.16) v1(8.89,42.08) v1(10.42,28.2) v1(10.42,23.12) v1(10.42,18.04) v1(10.42,10.42) v1(10.42,6.32) v1(10.42,4.42) v1(12.96,28.2) v1(12.96,23.12) v1(12.96,18.04) v1(12.96,10.42) v1(12.96,6.32) v1(12.96,4.42) v1(13.97,52.24) v1(13.97,47.16) v1(13.97,42.08) v1(14.6,38.27) v1(15.5,28.2) v1(18.04,28.2) v1(18.04,19.31) v1(19.05,52.24) v1(19.05,47.16) v1(19.05,42.08) v1(20.58,10.42) v1(22.22,26.21) v1(23.12,5.34) v1(23.55,28.87) v1(23.55,24.3) v1(24.13,52.24) v1(24.13,47.16) v1(24.8,28.87) v1(24.76,24.3) v1(25.66,20.58) v1(28.2,20.58) v1(28.2,5.34) v1(29.21,52.24) v1(29.21,47.16) v1(29.71,12.38) v1(30.74,20.58) v1(30.74,5.34) v1(33.28,28.2) v1(33.28,26.29) v1(34.29,52.24) v1(34.29,47.16) v1(34.29,42.08) v1(35.82,28.2) v1(35.82,26.29) v1(35.82,12.96) v1(35.82,10.42) v1(35.82,7.88) v1(35.82,5.34) v1(35.82,2.8) v1(38.36,28.2) v1(38.36,26.29) v1(38.36,20.58) v1(38.36,18.04) v1(38.36,16.51) v1(38.36,5.34) v1(39.37,52.24) v1(39.37,47.16) v1(39.37,42.08) v1(39.37,38.27) v1(40.9,28.2) v1(40.9,26.29) v1(40.9,2.8) v1(43.44,28.2) v1(43.44,5.34) v1(43.44,2.8) v1(43.93,15.09) v1(43.93,14.19) v1(44.45,52.24) v1(44.45,47.16) v1(45.19,15.09) v1(45.19,14.19) v1(45.57,44.5) v1(45.57,41.45) v1(45.57,38.27) v1(45.98,28.2) v1(45.98,7.88) v1(45.98,2.8) v1(48.52,25.66) v1(48.52,23.12) v1(48.52,18.04) v1(48.52,16.51) v1(48.52,15.01) v1(48.52,2.8) v1(48.9,44.5) v1(48.9,38.27) v1(49.53,52.24) v1(49.53,47.16) v1(51.06,25.66) v1(51.06,23.12) v1(51.06,20.58) v1(51.06,18.04) v1(51.06,16.51) v1(51.06,15.01) v1(51.06,7.88) v1(51.06,5.34) v1(51.06,2.8) v1(52.07,44.5) v1(52.07,41.45)
VIN:
  vias: v1(28.63,67.31) v1(28.63,66.09) v1(28.63,59.99) v1(28.63,58.77) v1(29.84,67.31) v1(29.84,66.09) v1(29.84,59.99) v1(29.84,58.77) v1(31.06,67.31) v1(31.06,66.09) v1(31.06,59.99) v1(31.06,58.77) v1(32.28,67.31) v1(32.28,66.09) v1(32.28,59.99) v1(32.28,58.77) v1(33.5,67.31) v1(33.5,66.09) v1(33.5,59.99) v1(33.5,58.77) v1(34.72,67.31) v1(34.72,66.09) v1(34.72,59.99) v1(34.72,58.77) v1(35.94,67.31) v1(35.94,66.09) v1(35.94,59.99) v1(35.94,58.77) v1(37.16,67.31) v1(37.16,66.09) v1(37.16,59.99) v1(37.16,58.77) v1(38.38,67.31) v1(38.38,66.09) v1(38.38,64.87) v1(38.38,63.65) v1(38.38,62.43) v1(38.38,61.21) v1(38.38,59.99) v1(38.38,58.77) v1(39.6,67.31) v1(39.6,66.09) v1(39.6,64.87) v1(39.6,63.65) v1(39.6,62.43) v1(39.6,61.21) v1(39.6,59.99) v1(39.6,58.77) v1(40.82,67.31) v1(40.82,66.09) v1(40.82,64.87) v1(40.82,63.65) v1(40.82,62.43) v1(40.82,61.21) v1(40.82,59.99) v1(40.82,58.77) v1(42.04,67.31) v1(42.04,66.09) v1(42.04,64.87) v1(42.04,63.65) v1(42.04,62.43) v1(42.04,61.21) v1(42.04,59.99) v1(42.04,58.77) v1(43.26,67.31) v1(43.26,66.09) v1(43.26,64.87) v1(43.26,63.65) v1(43.26,62.43) v1(43.26,61.21) v1(43.26,59.99) v1(43.26,58.77) v1(44.48,67.31) v1(44.48,66.09) v1(44.48,64.87) v1(44.48,63.65) v1(44.48,62.43) v1(44.48,61.21) v1(44.48,59.99) v1(44.48,58.77) v1(45.69,67.31) v1(45.69,66.09) v1(45.69,64.87) v1(45.69,63.65) v1(45.69,62.43) v1(45.69,61.21) v1(45.69,59.99) v1(45.69,58.77) v1(46.91,67.31) v1(46.91,66.09) v1(46.91,64.87) v1(46.91,63.65) v1(46.91,62.43) v1(46.91,61.21) v1(46.91,59.99) v1(46.91,58.77) v1(48.13,62.43) v1(48.13,61.21) v1(48.13,59.99) v1(48.13,58.77) v1(49.35,62.43) v1(49.35,61.21) v1(49.35,59.99) v1(49.35,58.77) v1(50.57,62.43) v1(50.57,61.21) v1(50.57,59.99) v1(50.57,58.77) v1(51.79,62.43) v1(51.79,61.21) v1(51.79,59.99) v1(51.79,58.77)
CURR_SENSE: length 10.3
  Top Layer w0.254: U5.7 R11.2 TP5.1 26.05,22.85 CN3.4
IOUT: length 19.5
  Top Layer w0.254: 29.21,1.29 TP4.1 R15.1 ; H1.3 29.21,39.54 28.58,40.17 U1.3
VOLT_SENSE: length 33.3
  Top Layer w0.254: CN3.3 v1(27.3,24.73) ; 15.17,6.42 15.17,4.42 TP3.1 17.38,4.48 U4.4 v1(18.45,6.42)
  Bottom Layer w0.254: v1(18.45,6.42) 21.72,9.7 23.5,9.7 24.13,10.33 24.13,17.32 27.3,20.48 v1(27.3,24.73)
VOUT: length 74.6
  Top Layer w0.254: LED1.2 U3.10 ; v1(5.34,6.26) 4.03,6.26 R7.2 ; 31.75,1.29 v1(31.75,3.22)
  Top Layer w0.762: H1.4 31.75,42.08 30.48,43.35 17.78,43.35 16.51,44.62 16.51,59.86 NOREF#3.1
  Bottom Layer w0.254: v1(31.75,3.22) 8.38,3.22 v1(5.34,6.26)
  vias: v1(1.55,62.43) v1(1.55,61.21) v1(1.55,59.99) v1(1.55,58.77) v1(2.77,62.43) v1(2.77,61.21) v1(2.77,59.99) v1(2.77,58.77) v1(3.99,62.43) v1(3.99,61.21) v1(3.99,59.99) v1(3.99,58.77) v1(5.21,62.43) v1(5.21,61.21) v1(5.21,59.99) v1(5.21,58.77) v1(6.43,67.31) v1(6.43,66.09) v1(6.43,64.87) v1(6.43,63.65) v1(6.43,62.43) v1(6.43,61.21) v1(6.43,59.99) v1(6.43,58.77) v1(7.65,67.31) v1(7.65,66.09) v1(7.65,64.87) v1(7.65,63.65) v1(7.65,62.43) v1(7.65,61.21) v1(7.65,59.99) v1(7.65,58.77) v1(8.86,67.31) v1(8.86,66.09) v1(8.86,64.87) v1(8.86,63.65) v1(8.86,62.43) v1(8.86,61.21) v1(8.86,59.99) v1(8.86,58.77) v1(10.08,67.31) v1(10.08,66.09) v1(10.08,64.87) v1(10.08,63.65) v1(10.08,62.43) v1(10.08,61.21) v1(10.08,59.99) v1(10.08,58.77) v1(11.3,67.31) v1(11.3,66.09) v1(11.3,64.87) v1(11.3,63.65) v1(11.3,62.43) v1(11.3,61.21) v1(11.3,59.99) v1(11.3,58.77) v1(12.52,67.31) v1(12.52,66.09) v1(12.52,64.87) v1(12.52,63.65) v1(12.52,62.43) v1(12.52,61.21) v1(12.52,59.99) v1(12.52,58.77) v1(13.74,67.31) v1(13.74,66.09) v1(13.74,64.87) v1(13.74,63.65) v1(13.74,62.43) v1(13.74,61.21) v1(13.74,59.99) v1(13.74,58.77) v1(14.96,67.31) v1(14.96,66.09) v1(14.96,64.87) v1(14.96,63.65) v1(14.96,62.43) v1(14.96,61.21) v1(14.96,59.99) v1(14.96,58.77) v1(16.18,67.31) v1(16.18,66.09) v1(16.18,59.99) v1(16.18,58.77) v1(17.4,67.31) v1(17.4,66.09) v1(17.4,59.99) v1(17.4,58.77) v1(18.62,67.31) v1(18.62,66.09) v1(18.62,59.99) v1(18.62,58.77) v1(19.84,67.31) v1(19.84,66.09) v1(19.84,59.99) v1(19.84,58.77) v1(21.06,67.31) v1(21.06,66.09) v1(21.06,59.99) v1(21.06,58.77) v1(22.28,67.31) v1(22.28,66.09) v1(22.28,59.99) v1(22.28,58.77) v1(23.5,67.31) v1(23.5,66.09) v1(23.5,59.99) v1(23.5,58.77) v1(24.71,67.31) v1(24.71,66.09) v1(24.71,59.99) v1(24.71,58.77)
$2N1941: length 4.4
  Top Layer w0.254: 32.25,7.79 32.25,9.66 U2.8
$2N1954: length 4
  Top Layer w0.254: U2.7 29.96,10.45 30.85,9.56 30.85,7.79
$2N2099: length 2.1
  Top Layer w0.254: U2.3 29.46,14.24 29.71,14.49 C4.2
$2N2496: length 4
  Top Layer w0.254: U3.3 44.56,17.84 43.88,18.52 C9.2
$2N2548: length 4.7
  Top Layer w0.508: 48.31,20.54 48.31,19.51 45.72,16.91
$2N2851: length 6.6
  Top Layer w0.254: 43.56,12.53 43.46,12.63 C7.1 R3.1 R6.2
$2N2997: length 3.6
  Top Layer w0.254: U3.4 44.06,17.71 43.19,18.58 R5.2
$2N3104: length 3.5
  Top Layer w0.254: U3.7 44.06,11.77 42.69,10.4 41.91,10.4
$2N3367: length 2.2
  Top Layer w0.254: LED1.1 50.92,12.53 R4.1
$2N3370: length 7.8
  Top Layer w0.254: U3.8 44.56,10.85 v1(44.04,10.33) ; v1(48.26,10.33) R4.2
  Bottom Layer w0.254: v1(48.26,10.33) v1(44.04,10.33)
$2N3554: length 4
  Top Layer w0.254: U2.5 28.96,10.61 R1.2 R2.1
$3N1151: length 13.5
  Top Layer w0.254: 4.03,17.44 4.03,19.35 ; 4.03,19.35 R9.1 ; 4.03,19.35 4.07,19.32 U5.3
$3N1179: length 13.1
  Top Layer w0.254: 15.17,7.72 15.12,7.78 R7.1 R8.2
$3N1197: length 3.8
  Top Layer w0.254: U5.2 U5.1 R10.1
$3N1204: length 13.1
  Top Layer w0.254: R10.2 v1(18.3,24.4) ; U5.6 22.23,19.32 v1(22.47,19.08) R11.1
  Bottom Layer w0.254: v1(18.3,24.4) 18.3,20.19 19.41,19.08 v1(22.47,19.08)
$3N1213: length 4
  Top Layer w0.254: R15.2 R16.2 U5.5
$3N9954: length 7.2
  Top Layer w0.254: R14.1 15.56,16.11 15.61,16.05 ; 15.61,16.05 15.66,16.11 R13.1 ; 15.61,16.05 U5.4

## Copper pours and planes (outline as drawn; the poured copper is in the pictures)
+5V on Top Layer: 27.94,27.78 30.48,27.78 30.48,23.03 27.94,23.03
GND on Top Layer: 0,31.78 53.34,31.78 53.34,0 0,0
GND on Top Layer: 0,56.59 53.34,56.59 53.34,36.97 0,36.97
GND on Bottom Layer: 0,56.59 53.34,56.59 53.34,36.97 0,36.97
GND on Bottom Layer: 0,31.78 53.34,31.78 53.34,0 0,0
VOUT on Top Layer: 44.82,13.41 46.85,13.41 46.85,9.34 44.82,9.34
$2N2555 on Top Layer: 44.92,15.93 44.92,26.21 47.62,26.21 47.62,19.26 45.2,16.95 45.2,15.93

## Text on the board
Bottom Silkscreen Layer: 5V | GND | IOUT | VBAT | G | VOUT | Designed by / Sokratis Soutsiou / Ouzas Vasilios | 350A Hall Effect / Analog Power Meter | StarBound
Top Silkscreen Layer: 5V | G | IOUT | VOUT | GND | OUT+         IN+
